# Altium schematic sheet AT89S52.SchDoc
size A4; SheetNumber: 3; SheetTotal: 8
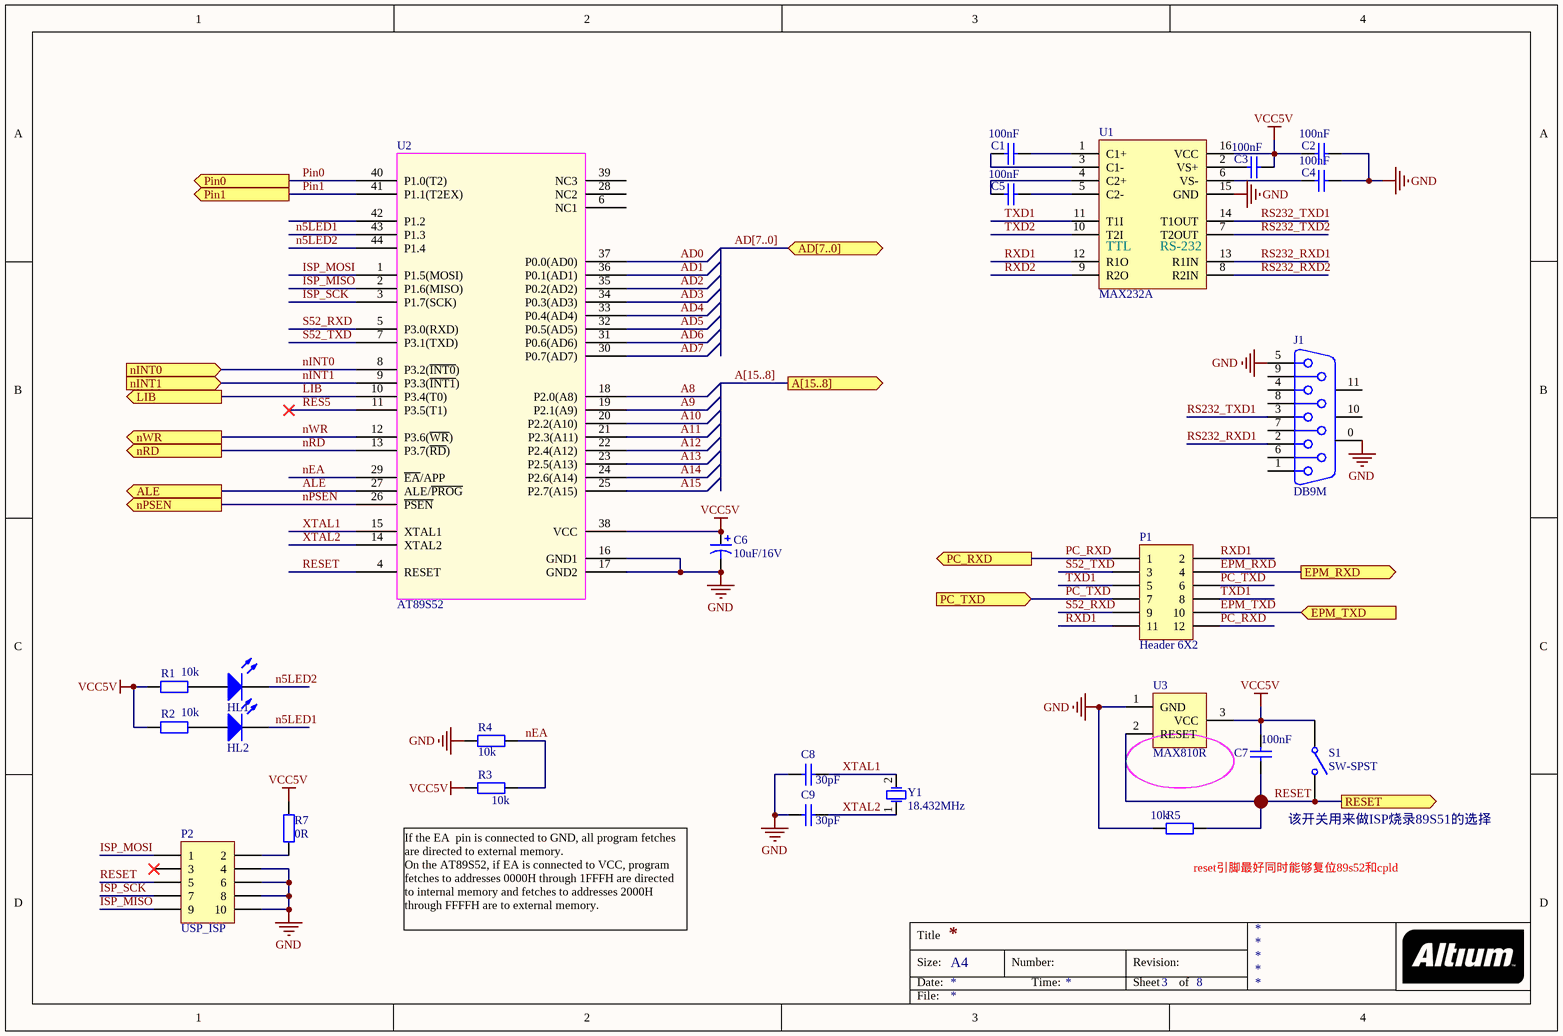
[diagram p0: AT89S52.SchDoc]

## Parts
C1  100nF  [R0603]
C2  100nF  [R0603]
C3  100nF  [R0603]
C4  100nF  [R0603]
C5  100nF  [R0603]
C6  10uF/16V  [C0805]
C7  100nF  [R0603]
C8  30pF  [R0603]
C9  30pF  [R0603]
HL1  LED  [LED_0603]  (value not drawn)
HL2  LED  [LED_0603]  (value not drawn)
J1  DB9M
P1  Header 6X2  [HDR2X6]
P2  USP_ISP  [HDR2X5]
R1  10k  [R0603]
R2  10k  [R0603]
R3  10k  [R0603]
R4  10k  [R0603]
R5  10k  [R0603]
R7  0R  [R0603]
S1  SW-SPST  [K1]
U1  MAX232A  [NSO16_M]
U2  AT89S52  [AT89S52-TQFP44]
U3  MAX810R  [MAX810R-SOT23]
Y1  18.432MHz  [XTAL]

## Ports
A[15..8] (out), AD[7..0] (bidir), ALE (out), EPM_RXD (out), EPM_TXD (in), LIB (out), nINT0 (in), nINT1 (in), nPSEN (out), nRD (out), nWR (out), PC_RXD (out), PC_TXD (in), Pin0 (out), Pin1 (out), RESET (out)

## Nets
GND: C2.1 C4.1 C6.2 C8.2 C9.2 J1.0 J1.5 P2.4 P2.6 P2.8 P2.10 R4.1 R5.1 U1.15(GND) U2.16(GND1) U2.17(GND2) U3.1(GND)
VCC5V: C2.2 C3.1 C6.1 C7.2 R1.2 R2.2 R3.2 R7.1 S1.1(COMMON) U1.16(VCC) U2.38(VCC) U3.3(VCC)
A8: U2.18(P2.0(A8))
A9: U2.19(P2.1(A9))
A10: U2.20(P2.2(A10))
A11: U2.21(P2.3(A11))
A12: U2.22(P2.4(A12))
A13: U2.23(P2.5(A13))
A14: U2.24(P2.6(A14))
A15: U2.25(P2.7(A15))
AD0: U2.37(P0.0(AD0))
AD1: U2.36(P0.1(AD1))
AD2: U2.35(P0.2(AD2))
AD3: U2.34(P0.3(AD3))
AD4: U2.33(P0.4(AD4))
AD5: U2.32(P0.5(AD5))
AD6: U2.31(P0.6(AD6))
AD7: U2.30(P0.7(AD7))
ALE: U2.27(ALE/~{PROG}) ; port ALE
EPM_RXD: P1.4 ; port EPM_RXD
EPM_TXD: P1.10 ; port EPM_TXD
ISP_MISO: P2.9 U2.2(P1.6(MISO))
ISP_MOSI: P2.1 U2.1(P1.5(MOSI))
ISP_SCK: P2.7 U2.3(P1.7(SCK))
LIB: U2.10(P3.4(T0)) ; port LIB
n5LED1: HL2.K U2.43(P1.3)
n5LED2: HL1.K U2.44(P1.4)
nEA: R3.1 R4.2 U2.29(~{EA}/APP)
nINT0: U2.8(P3.2(~{INT0})) ; port nINT0
nINT1: U2.9(P3.3(~{INT1})) ; port nINT1
nPSEN: U2.26(~{PSEN}) ; port nPSEN
nRD: U2.13(P3.7(~{RD})) ; port nRD
nWR: U2.12(P3.6(~{WR})) ; port nWR
PC_RXD: P1.1 P1.12 ; port PC_RXD
PC_TXD: P1.6 P1.7 ; port PC_TXD
Pin0: U2.40(P1.0(T2)) ; port Pin0
Pin1: U2.41(P1.1(T2EX)) ; port Pin1
RES5: U2.11(P3.5(T1))
RESET: C7.1 P2.5 R5.2 S1.2(NO) U2.4(RESET) U3.2(RESET) ; port RESET
RS232_RXD1: J1.2 U1.13(R1IN)
RS232_RXD2: U1.8(R2IN)
RS232_TXD1: J1.3 U1.14(T1OUT)
RS232_TXD2: U1.7(T2OUT)
RXD1: P1.2 P1.11 U1.12(R1O)
RXD2: U1.9(R2O)
S52_RXD: P1.9 U2.5(P3.0(RXD))
S52_TXD: P1.3 U2.7(P3.1(TXD))
TXD1: P1.5 P1.8 U1.11(T1I)
TXD2: U1.10(T2I)
XTAL1: C8.1 U2.15(XTAL1) Y1.2(OSC2)
XTAL2: C9.1 U2.14(XTAL2) Y1.1(OSC1)
NetC1_1: C1.1 U1.1(C1+)
NetC1_2: C1.2 U1.3(C1-)
NetC3_2: C3.2 U1.2(VS+)
NetC4_2: C4.2 U1.6(VS-)
NetC5_1: C5.1 U1.5(C2-)
NetC5_2: C5.2 U1.4(C2+)
NetHL1_A: HL1.A R1.1
NetHL2_A: HL2.A R2.1
NetP2_2: P2.2 R7.2

Not connected (* = marked no-connect by the designer): J1 1 4 6 7 8 9 10(MH1) 11(MH2); P2 3*; U2 6(NC1) 28(NC2) 39(NC3) 42(P1.2)

## Buses and harness runs
bus A[15..8] = port A[15..8]
bus AD[7..0] = port AD[7..0]

## Notes on the sheet
- 该开关用来做ISP烧录89S51的选择
- (near R3) If the EA  pin is connected to GND, all program fetches
  are directed to external memory.
  On the AT89S52, if EA is connected to VCC, program
  fetches to addresses 0000H through 1FFFH are directed
  to internal memory and fetches to addresses 2000H
  through FFFFH are to external memory.
- (near R5) reset引脚最好同时能够复位89s52和cpld
- Title
- Size:
- Date:
- A4
- Number:
- Time:
- Revision:
- Sheet
- of
- File:
- (in symbol MAX232A) TTL; RS-232

## Library data of the parts
C1-C5 C7 = CAP_04: Value: 100nF
C6 = CAP_A
C8 C9 = CAP_04: Value: 100nF
HL1 HL2 = LED 2
P1 = Header 6X2: Header, 6-Pin, Dual row; LatestRevisionDate: 17-Jul-2002; LatestRevisionNote: Re-released for DXP Platform.; Publisher: Altium Limited
P2 = Header 5X2: Header, 5-Pin, Dual row; LatestRevisionDate: 17-Jul-2002; LatestRevisionNote: Re-released for DXP Platform.; Publisher: Altium Limited
R1 R2 = RES_04: Value: 10K
R3 = RES_04: 0402R; Value: 10K
R4 R5 = RES_04: 0402; Value: 10K
R7 = RES_04: 0402R; Value: 10K
S1 = SW-SPST: Single-Pole, Single-Throw Switch; Published: 24-Mar-1999; LatestRevisionDate: 17-Jul-2002; LatestRevisionNote: Re-released for DXP Platform.; PackageReference: SPST-2; Publisher: Altium Limited; PackageDescription: Switch; 2 Leads
U1 = MAX232A: +5V-Powered, Multichannel RS-232 Drivers/Receivers
U2 = AT89S52-24U
Y1 = XTAL: Passive crystal